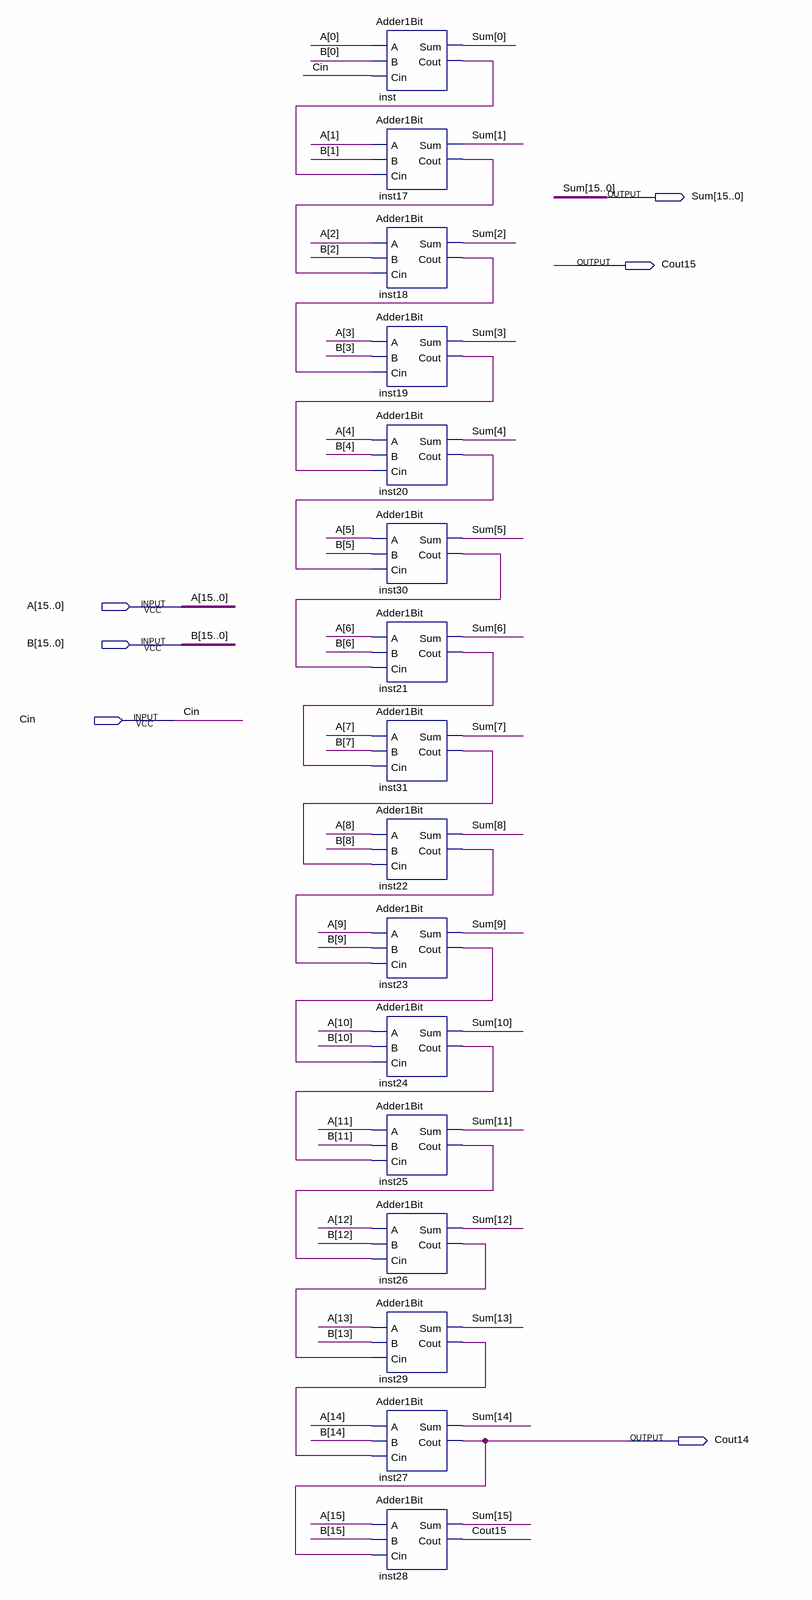
[diagram p0: schematic sheet]
// Quartus schematic Adder16Bit.bdf as structural Verilog: 16 symbols, 6 pins
module Adder16Bit (
  input  [15:0] A,
  input  [15:0] B,
  input  Cin,
  output [15:0] Sum,
  output Cout15,
  output Cout14
);

  wire inst17_cout, inst18_cout, inst19_cout, inst20_cout, inst21_cout, inst22_cout, inst23_cout,
       inst24_cout, inst25_cout, inst26_cout, inst29_cout, inst30_cout, inst31_cout, inst_cout;

  Adder1Bit inst (.A(A[0]), .B(B[0]), .Cin(Cin), .Sum(Sum[0]), .Cout(inst_cout));
  Adder1Bit inst17 (.A(A[1]), .B(B[1]), .Cin(inst_cout), .Sum(Sum[1]), .Cout(inst17_cout));
  Adder1Bit inst18 (.A(A[2]), .B(B[2]), .Cin(inst17_cout), .Sum(Sum[2]), .Cout(inst18_cout));
  Adder1Bit inst19 (.A(A[3]), .B(B[3]), .Cin(inst18_cout), .Sum(Sum[3]), .Cout(inst19_cout));
  Adder1Bit inst20 (.A(A[4]), .B(B[4]), .Cin(inst19_cout), .Sum(Sum[4]), .Cout(inst20_cout));
  Adder1Bit inst30 (.A(A[5]), .B(B[5]), .Cin(inst20_cout), .Sum(Sum[5]), .Cout(inst30_cout));
  Adder1Bit inst21 (.A(A[6]), .B(B[6]), .Cin(inst30_cout), .Sum(Sum[6]), .Cout(inst21_cout));
  Adder1Bit inst31 (.A(A[7]), .B(B[7]), .Cin(inst21_cout), .Sum(Sum[7]), .Cout(inst31_cout));
  Adder1Bit inst22 (.A(A[8]), .B(B[8]), .Cin(inst31_cout), .Sum(Sum[8]), .Cout(inst22_cout));
  Adder1Bit inst23 (.A(A[9]), .B(B[9]), .Cin(inst22_cout), .Sum(Sum[9]), .Cout(inst23_cout));
  Adder1Bit inst24 (.A(A[10]), .B(B[10]), .Cin(inst23_cout), .Sum(Sum[10]), .Cout(inst24_cout));
  Adder1Bit inst25 (.A(A[11]), .B(B[11]), .Cin(inst24_cout), .Sum(Sum[11]), .Cout(inst25_cout));
  Adder1Bit inst26 (.A(A[12]), .B(B[12]), .Cin(inst25_cout), .Sum(Sum[12]), .Cout(inst26_cout));
  Adder1Bit inst29 (.A(A[13]), .B(B[13]), .Cin(inst26_cout), .Sum(Sum[13]), .Cout(inst29_cout));
  Adder1Bit inst27 (.A(A[14]), .B(B[14]), .Cin(inst29_cout), .Sum(Sum[14]), .Cout(Cout14));
  Adder1Bit inst28 (.A(A[15]), .B(B[15]), .Cin(Cout14), .Sum(Sum[15]), .Cout(Cout15));
endmodule
